# EAGLE design ziffy_board_v2 (EAGLE 6.5.0)
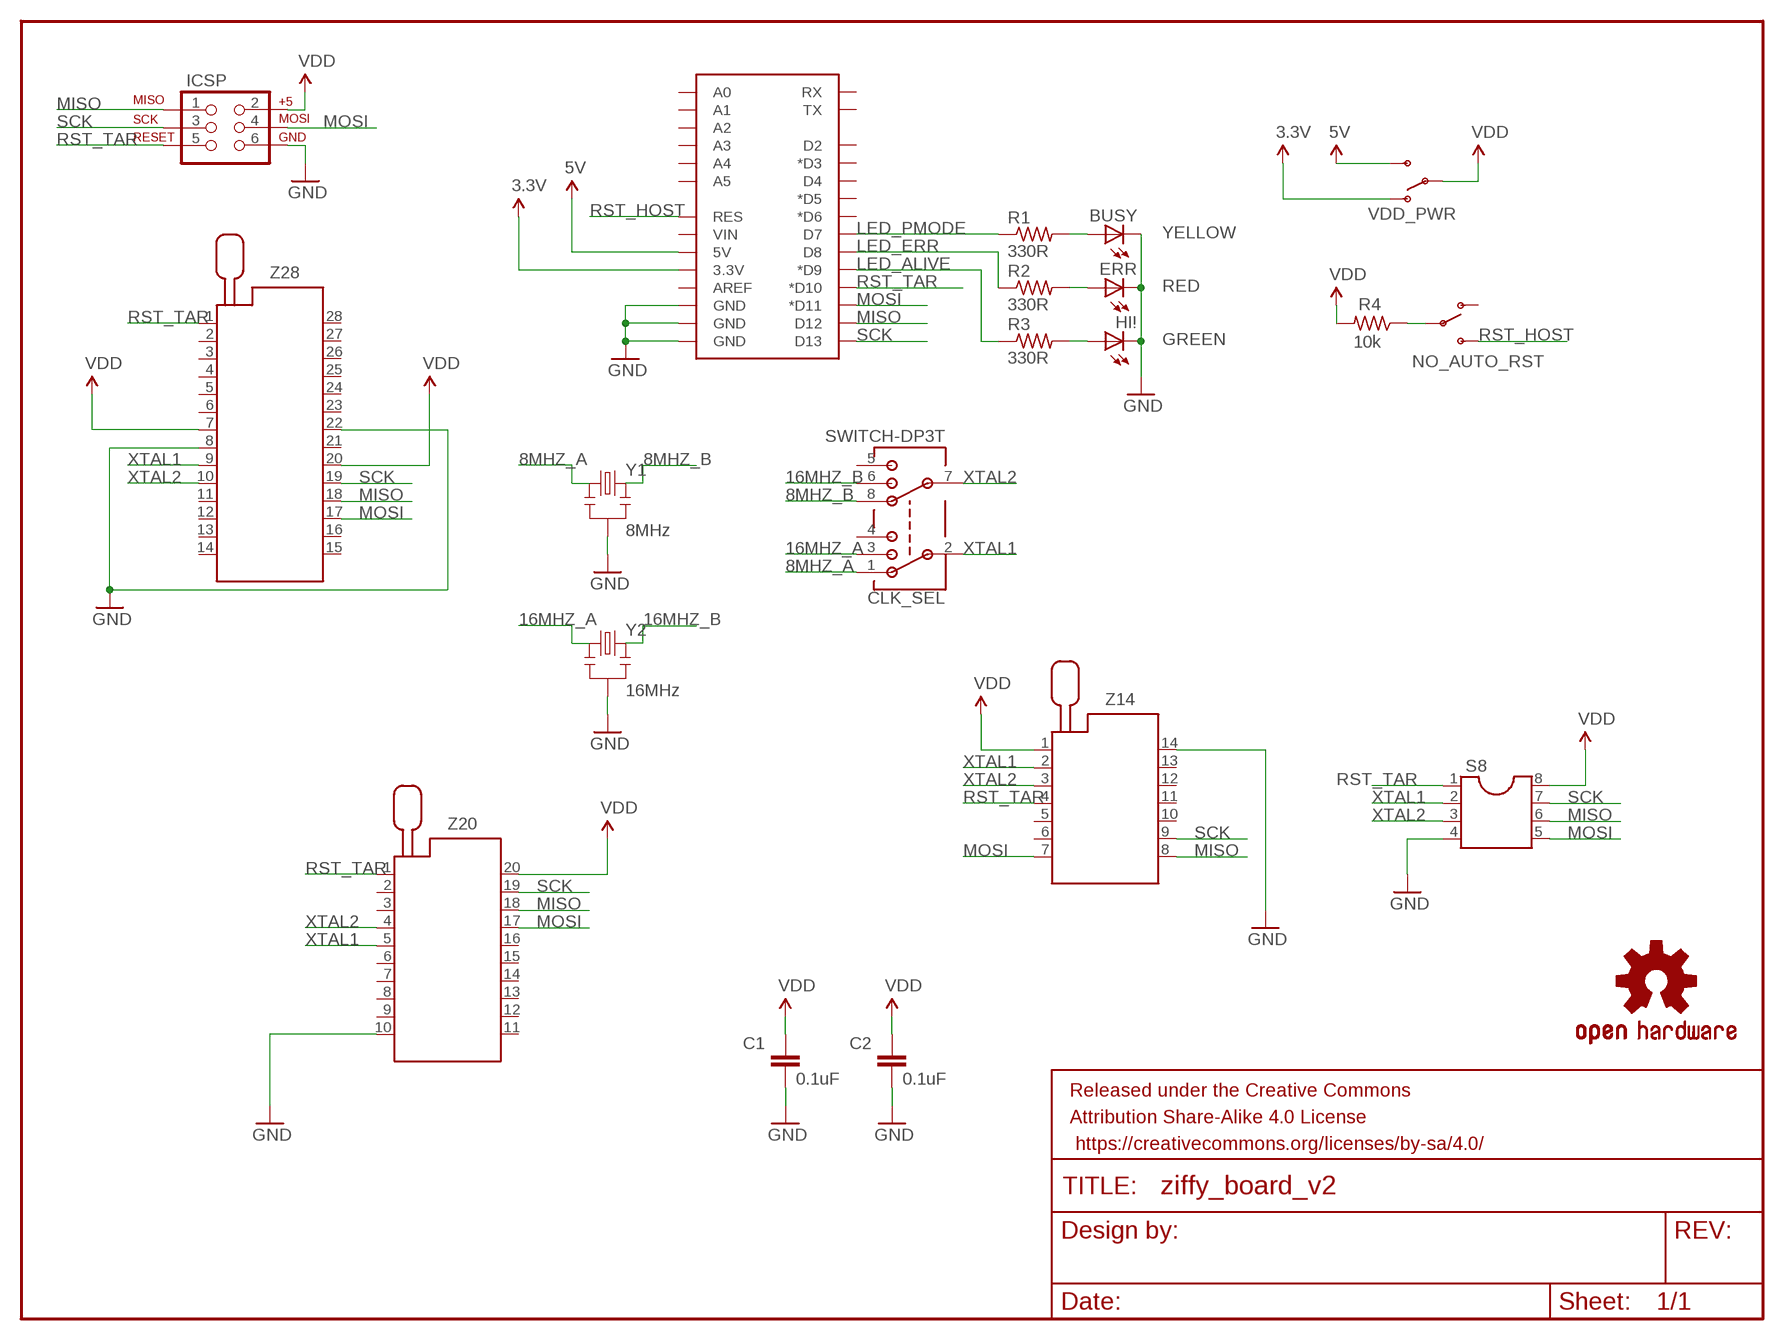
[diagram p0: schematic, sheet 1]

## Parts
BUSY  YELLOW  LED3MM  [LED3MM]
C1  0.1uF  C-EU025-025X050  [C025-025X050]
C2  0.1uF  C-EU025-025X050  [C025-025X050]
CLK_SEL  SWITCH-DP3T  [SWITCH-DP3T]
ERR  RED  LED3MM  [LED3MM]
FRAME1  FRAME-LETTER  [CREATIVE_COMMONS]
HI!  GREEN  LED3MM  [LED3MM]
ICSP  AVR_SPI_PRG_6PTH  [2X3]
LOGO1  OSHW-LOGOS  [OSHW-LOGO-S]
NO_AUTO_RST  SWITCH-SPDTPTH  [SWITCH-SPDT]
R1  330R  R-US_0204/5  [0204/5]
R2  330R  R-US_0204/5  [0204/5]
R3  330R  R-US_0204/5  [0204/5]
R4  10k  R-US_0204/5  [0204/5]
S8  DIPSHIT  DIL8  [DIL08]
U$1  ARDUINO_SHIELD  [SHIELD_NO_OUTLINE]
VDD_PWR  SWITCH-SPDTPTH  [SWITCH-SPDT]
Y1  8MHz  RESONATORPTH  [RESONATOR-PTH]
Y2  16MHz  RESONATORPTH  [RESONATOR-PTH]
Z14  ZIF14  [ZIF14]
Z20  ZIF20  [ZIF20]
Z28  ZIF28  [ZIF28]

## Nets
3.3V: U$1.3.3V VDD_PWR.1(O)
5V: U$1.5V VDD_PWR.3(S)
8MHZ_A: CLK_SEL.1 Y1.1
8MHZ_B: CLK_SEL.8 Y1.3
16MHZ_A: CLK_SEL.3 Y2.1
16MHZ_B: CLK_SEL.6 Y2.3
GND: BUSY.K(C) C1.2 C2.2 ERR.K(C) HI!.K(C) ICSP.6 S8.4 U$1.GND@0(GND) U$1.GND@1(GND) U$1.GND@2(GND) Y1.2 Y2.2 Z14.14 Z20.10 Z28.8 Z28.22
LED_ALIVE: R3.1 U$1.D9(*D9)
LED_ERR: R2.1 U$1.D8
LED_PMODE: R1.1 U$1.D7
MISO: ICSP.1 S8.6 U$1.D12 Z14.8 Z20.18 Z28.18
MOSI: ICSP.4 S8.5 U$1.D11(*D11) Z14.7 Z20.17 Z28.17
N$1: HI!.A R3.2
N$2: ERR.A R2.2
N$3: BUSY.A R1.2
N$4: NO_AUTO_RST.2(P) R4.1
RST_HOST: NO_AUTO_RST.3(S) U$1.RES
RST_TAR: ICSP.5 S8.1 U$1.D10(*D10) Z14.4 Z20.1 Z28.1
SCK: ICSP.3 S8.7 U$1.D13 Z14.9 Z20.19 Z28.19
VDD: C1.1 C2.1 ICSP.2 R4.2 S8.8 VDD_PWR.2(P) Z14.1 Z20.20 Z28.7 Z28.20
XTAL1: CLK_SEL.2 S8.2 Z14.2 Z20.5 Z28.9
XTAL2: CLK_SEL.7 S8.3 Z14.3 Z20.4 Z28.10
Unconnected: CLK_SEL.4 CLK_SEL.5 NO_AUTO_RST.1(O) U$1.A0 U$1.A1 U$1.A2 U$1.A3 U$1.A4 U$1.A5 U$1.AREF U$1.D2 U$1.D3(*D3) U$1.D4 U$1.D5(*D5) U$1.D6(*D6) U$1.RX U$1.TX U$1.VIN Z14.5 Z14.6 Z14.10 Z14.11 Z14.12 Z14.13 Z20.2 Z20.3 Z20.6 Z20.7 Z20.8 Z20.9 Z20.11 Z20.12 Z20.13 Z20.14 Z20.15 Z20.16 Z28.2 Z28.3 Z28.4 Z28.5 Z28.6 Z28.11 Z28.12 Z28.13 Z28.14 Z28.15 Z28.16 Z28.21 Z28.23 Z28.24 Z28.25 Z28.26 Z28.27 Z28.28

## Library data of the parts
BUSY ERR HI! = led:LED: LED OSRAM: - CHIPLED LG R971, LG N971, LY N971, LG Q971, LY Q971, LO R971, LY R971 LH N974, LH R974 LS Q976, LO Q976, LY Q976 LO Q996 - Hyper CHIPLED LW Q18S LB Q993, LB Q99A, LB R99A - SideLED LS A670, LO A670, LY A670, LG A670, LP A670 LB A673, LV A673, LT A673, LW A673 LH A674 LY A675 LS A676, LA A676, LO A676, LY A676, LW A676 LS A679, LY A679, LG A679 - Hyper Micro SIDELED® LS Y876, LA Y876, LO Y876, LY Y876 LT Y87S - SmartLED LW L88C, LW L88S LB L89C, LB L89S, LG L890 LS L89K, LO L89K, LY L89K LS L896, LA L896, LO L896, LY L896 - TOPLED LS T670, LO T670, LY T670, LG T670, LP T670 LSG T670, LSP T670, LSY T670, LOP T670, LYG T670 LG T671, LOG T671, LSG T671 LB T673, LV T673, LT T673, LW T673 LH T674 LS T676, LA T676, LO T676, LY T676, LB T676, LH T676, LSB T676, LW T676 LB T67C, LV T67C, LT T67C, LS T67K, LO T67K, LY T67K, LW E67C LS E67B, LA E67B, LO E67B, LY E67B, LB E67C, LV E67C, LT E67C LW T67C LS T679, LY T679, LG T679 LS T770, LO T770, LY T770, LG T770, LP T770 LB T773, LV T773, LT T773, LW T773 LH T774 LS E675, LA E675, LY E675, LS T675 LS T776, LA T776, LO T776, LY T776, LB T776 LHGB T686 LT T68C, LB T68C - Hyper Mini TOPLED® LB M676 - Mini TOPLED Santana® LG M470 LS M47K, LO M47K, LY M47K Source: http://www.osram.convergy.de LUXEON: - LUMILED® LXK2-PW12-R00, LXK2-PW12-S00, LXK2-PW14-U00, LXK2-PW14-V00 LXK2-PM12-R00, LXK2-PM12-S00, LXK2-PM14-U00 LXK2-PE12-Q00, LXK2-PE12-R00, LXK2-PE12-S00, LXK2-PE14-T00, LXK2-PE14-U00 LXK2-PB12-K00, LXK2-PB12-L00, LXK2-PB12-M00, LXK2-PB14-N00, LXK2-PB14-P00, LXK2-PB14-Q00 LXK2-PR12-L00, LXK2-PR12-M00, LXK2-PR14-Q00, LXK2-PR14-R00 LXK2-PD12-Q00, LXK2-PD12-R00, LXK2-PD12-S00 LXK2-PH12-R00, LXK2-PH12-S00 LXK2-PL12-P00, LXK2-PL12-Q00, LXK2-PL12-R00 Source: www.luxeon.com KINGBRIGHT: KA-3528ASYC Source: www.kingbright.com
C1 C2 = rcl:C-EU: CAPACITOR, European symbol
CLK_SEL = butts:SWITCH-DP3T
FRAME1 = SparkFun-Aesthetics:FRAME-LETTER: Schematic Frame Standard 8.5x11 US Letter frame
ICSP = SparkFun-Connectors:AVR_SPI_PRG_6: AVR ISP 6 Pin This is the reduced ISP connector for AVR programming. Common on Arduino. This footprint will take up less PCB space and can be used with a 10-pin to 6-pin adapter such as SKU: BOB-08508 **Special note about "TEST_POINT" package. The stop mask is on the top side, so if you want your programming test points to be on the bottom of your board, make sure to place this package on the bottom side of the board. This also ensure that the orientation to program from the bottom side will be correct.
LOGO1 = SparkFun-Aesthetics:OSHW-LOGO: Open Source Hardware Logo This logo indicates the piece of hardware it is found on incorporates a OSHW license and/or adheres to the definition of open source hardware found here: http://freedomdefined.org/OSHW
NO_AUTO_RST VDD_PWR = SparkFun-Electromechanical:SWITCH-SPDT: SPDT Switch Simple slide switch, Spark Fun Electronics SKU : COM-00102 DPDT SMT slide switch, AYZ0202, SWCH-08179
R1-R4 = rcl:R-US_: RESISTOR, American symbol
S8 = ic-package-mine:DIL8: Dual In Line / Socket
U$1 = butts:ARDUINO_SHIELD: Arduino shield footprint
Y1 Y2 = SparkFun-FreqCtrl:RESONATOR: Resonator Small SMD resonator. Used, eg, on the Arduino Pro/ Pro Mini boards. 8MHz- XTAL-08895 16MHz- XTAL-08900
Z14 = butts:ZIF14: Zero Insertion Force Socked Source: http://www.3M.com/ehpd; MF: 3M; MPN: 214-3339-00-0602J; OC_FARNELL: 1247151; OC_NEWARK: 85K7793
Z20 = butts:ZIF20: Zero Insertion Force Socked Source: http://www.3M.com/ehpd; MF: 3M; MPN: 220-3342-00-0602J; OC_FARNELL: 9897445; OC_NEWARK: 85K7807
Z28 = butts:ZIF28: Zero Insertion Force Socked Source: http://www.3M.com/ehpd

## Board
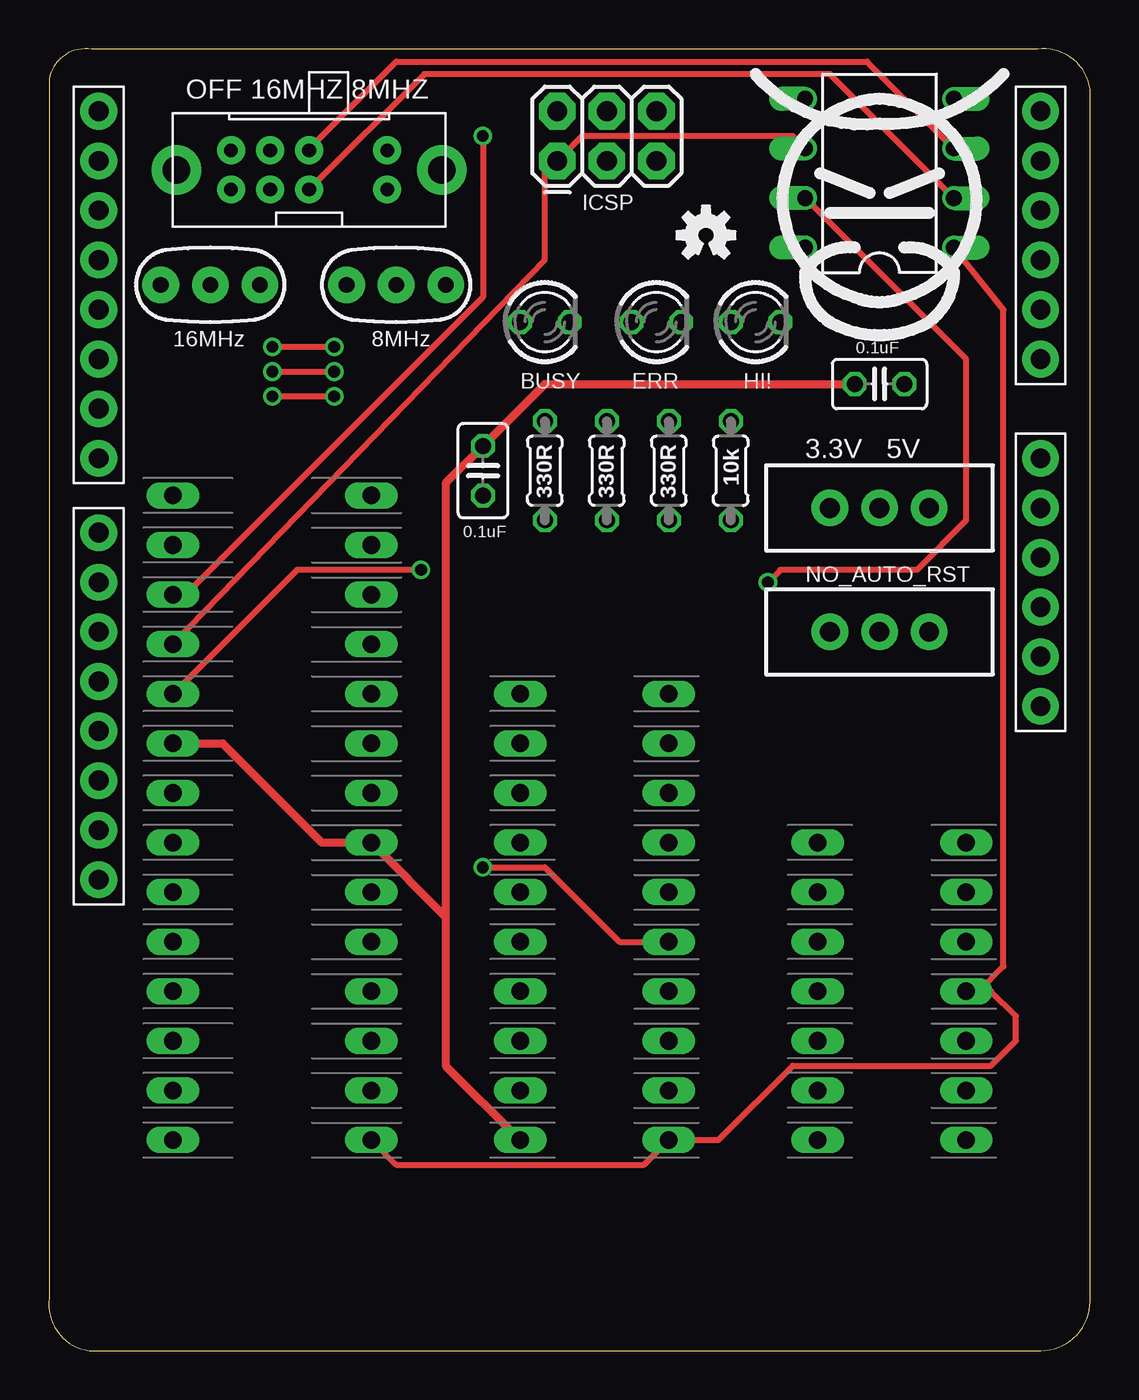
[diagram p1: board, top side]
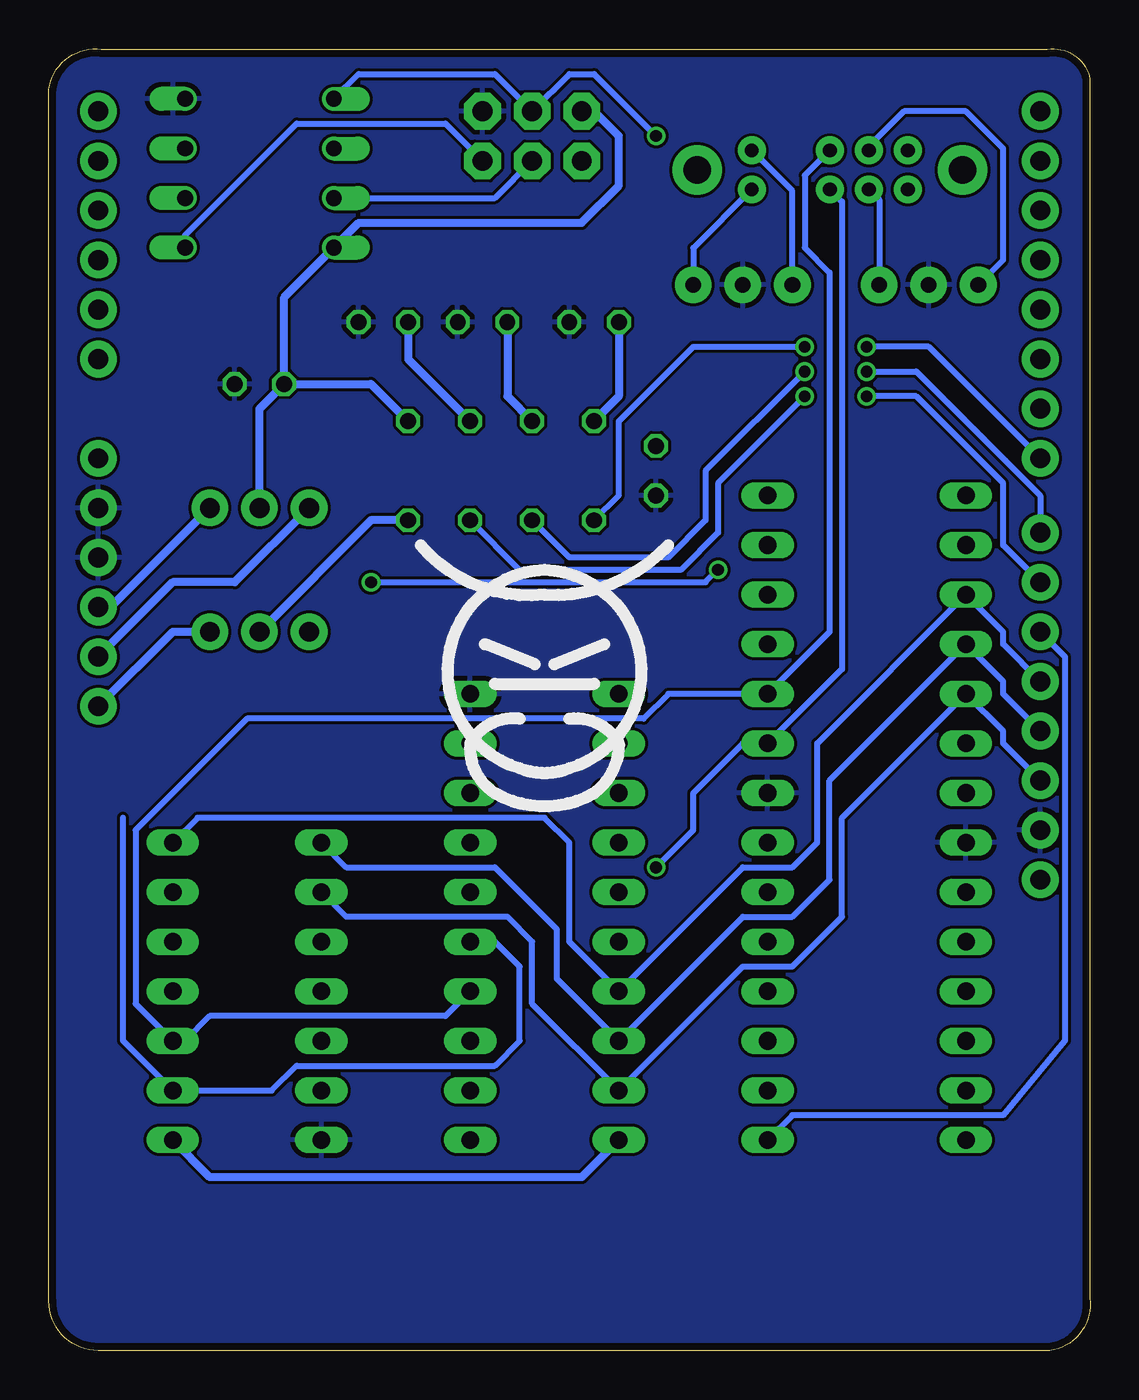
[diagram p2: board, bottom side, seen from below]

Size 53.36 x 66.7 mm. Coordinates in mm from the lower left corner, seen from the top.
Outline: 50.67,66.68 2.19,66.68 arc90 0.02,65.14 0.02,2.69 arc90 2.07,0 50.82,0 arc90 53.36,2.54 53.36,64.62 arc90 50.67,66.68
Copper layers (1*16): Top 0.0356mm / dielectric 1.5011mm / Bottom 0.0356mm
Design rules "LaenPCBOrder": minimum track width 6mil, minimum drill 13mil, track to track 6mil, track to pad 6mil, pad to pad 6mil, via to via 6mil, smd to smd 6mil, copper to edge 15mil, drill to drill 6mil, minimum pad ring 7mil, minimum via ring 7mil, stop-mask expansion 3mil, vias tented up to drill 0mil, thermal gap 10mil

### Footprints (pad centres in the part's own frame; a part is rotated, then mirrored left to right if it is on the bottom)
LED3MM = drill 0.813 octagon: A -1.27,0; K 1.27,0
C025-025X050 = drill 0.813 octagon: 1 -1.27,0; 2 1.27,0
SWITCH-DP3T = drill 0.7 pad 1.422: 1 3,4; 2 7,4; 3 9,4; 4 11,4; 5 11,2; 6 9,2; 7 7,2; 8 3,2 | drill 1.4 pad 2.54: MT1 0.2,3; MT3 13.8,3
2X3 = drill 1.016 pad 1.88 octagon: 1 0,0; 2 0,2.54; 3 2.54,0; 4 2.54,2.54; 5 5.08,0; 6 5.08,2.54
SWITCH-SPDT = drill 1.016 pad 1.88: 1 0,2.54; 2 0,0; 3 0,-2.54
0204/5 = drill 0.813 octagon: 1 -2.54,0; 2 2.54,0
DIL08 = drill 0.813 offset: 1 -3.81,-3.81; 2 -1.27,-3.81; 3 1.27,-3.81; 4 3.81,-3.81; 5 3.81,3.81; 6 1.27,3.81; 7 -1.27,3.81; 8 -3.81,3.81
SHIELD_NO_OUTLINE = drill 1.016 pad 1.88: 3.3V 50.8,13.97; 5V 50.8,16.51; A0 50.8,29.21; A1 50.8,31.75; A2 50.8,34.29; A3 50.8,36.83; A4 50.8,39.37; A5 50.8,41.91; AREF 2.54,2.54; D2 2.54,36.83; D3 2.54,34.29; D4 2.54,31.75; D5 2.54,29.21; D6 2.54,26.67; D7 2.54,24.13; D8 2.54,20.32; D9 2.54,17.78; D10 2.54,15.24; D11 2.54,12.7; D12 2.54,10.16; D13 2.54,7.62; GND@0 50.8,19.05; GND@1 50.8,21.59; GND@2 2.54,5.08; RES 50.8,11.43; RX 2.54,41.91; TX 2.54,39.37; VIN 50.8,24.13
RESONATOR-PTH = drill 0.8 pad 1.88: 1 -2.54,0; 2 0,0; 3 2.54,0
ZIF14 = drill 0.9 long: 1 -7.62,-3.81; 2 -5.08,-3.81; 3 -2.54,-3.81; 4 0,-3.81; 5 2.54,-3.81; 6 5.08,-3.81; 7 7.62,-3.81; 8 7.62,3.81; 9 5.08,3.81; 10 2.54,3.81; 11 0,3.81; 12 -2.54,3.81; 13 -5.08,3.81; 14 -7.62,3.81
ZIF20 = drill 0.9 long: 1 -11.43,-3.81; 2 -8.89,-3.81; 3 -6.35,-3.81; 4 -3.81,-3.81; 5 -1.27,-3.81; 6 1.27,-3.81; 7 3.81,-3.81; 8 6.35,-3.81; 9 8.89,-3.81; 10 11.43,-3.81; 11 11.43,3.81; 12 8.89,3.81; 13 6.35,3.81; 14 3.81,3.81; 15 1.27,3.81; 16 -1.27,3.81; 17 -3.81,3.81; 18 -6.35,3.81; 19 -8.89,3.81; 20 -11.43,3.81
ZIF28 = drill 0.9 long: 1 -16.51,-5.08; 2 -13.97,-5.08; 3 -11.43,-5.08; 4 -8.89,-5.08; 5 -6.35,-5.08; 6 -3.81,-5.08; 7 -1.27,-5.08; 8 1.27,-5.08; 9 3.81,-5.08; 10 6.35,-5.08; 11 8.89,-5.08; 12 11.43,-5.08; 13 13.97,-5.08; 14 16.51,-5.08; 15 16.51,5.08; 16 13.97,5.08; 17 11.43,5.08; 18 8.89,5.08; 19 6.35,5.08; 20 3.81,5.08; 21 1.27,5.08; 22 -1.27,5.08; 23 -3.81,5.08; 24 -6.35,5.08; 25 -8.89,5.08; 26 -11.43,5.08; 27 -13.97,5.08; 28 -16.51,5.08

### Placement (x,y rotation side)
BUSY  25.42,52.71 0 top
C1  22.24,45.09 270 top
C2  42.56,49.53 0 top
CLK_SEL  20.34,63.5 180 top
ERR  31.13,52.71 0 top
FRAME1  5.73,67.94 0 top
HI!  36.21,52.71 0 top
ICSP  26.05,60.96 0 top
LOGO1  33.67,57.15 0 top
NO_AUTO_RST  42.56,36.83 90 top
R1  25.42,45.09 90 top
R2  28.59,45.09 90 top
R3  31.77,45.09 90 top
R4  34.94,45.09 90 top
S8  42.56,60.32 90 top
U$1  0.02,21.59 0 top
U$2  [COW]  27.96,33.66 0 bottom
U$3  [COW]  42.56,57.79 0 top
VDD_PWR  42.56,43.18 90 top
Y1  17.8,54.61 180 top
Y2  8.27,54.61 180 top
Z14  43.2,18.41 90 top
Z20  27.96,22.23 90 top
Z28  11.45,27.3 90 top

### Tracks (layer width: path | path; a pad name or v marks a point on that pad's centre or on a via)
3.3V
  Bottom 0.406: VDD_PWR.1 43.83,39.37 47.01,39.37 U$1.3.3V
5V
  Bottom 0.406: U$1.5V 50.18,38.1 VDD_PWR.3
8MHZ_A
  Bottom 0.305: CLK_SEL.1 20.34,56.5 Y1.1
8MHZ_B
  Bottom 0.305: Y1.3 15.26,59.42 CLK_SEL.8
16MHZ_A
  Bottom 0.305: CLK_SEL.3 10.81,58.98 Y2.1
16MHZ_B
  Bottom 0.305: Y2.3 4.46,55.88 4.46,61.6 6.37,63.5 9.54,63.5 11.34,61.71 CLK_SEL.6
GND
  pour Bottom: 0.02,64.77 arc-90 1.92,66.68 50.82,66.68 arc-90 53.36,64.77 53.36,2.54 arc-90 50.18,0 1.92,0 arc-90 0.02,2.54
LED_ALIVE  (via drill 0.6)
  Top 0.305: v11.45,48.89 v14.62,48.89
  Bottom 0.305: R3.1 29.23,40.01 20.97,40.01 19.07,41.91 19.07,44.45 v14.62,48.89 | U$1.D9 4.46,41.27 4.46,44.45 8.91,48.89 v11.45,48.89
LED_ERR  (via drill 0.6)
  Top 0.305: v11.45,50.16 v14.62,50.16
  Bottom 0.305: v11.45,50.16 8.91,50.16 2.56,43.81 U$1.D8 | v14.62,50.16 19.7,45.09 19.7,42.55 21.61,40.64 26.69,40.64 R2.1
LED_PMODE  (via drill 0.6)
  Top 0.305: v11.45,51.43 v14.62,51.43
  Bottom 0.305: U$1.D7 8.27,51.43 v11.45,51.43 | R1.1 24.15,43.81 24.15,47.62 20.34,51.43 v14.62,51.43
MISO
  Top 0.305: S8.6 38.12,62.23 27.32,62.23 ICSP.1 25.42,60.32 25.42,55.88 Z28.18
  Bottom 0.305: U$1.D12 4.46,33.66 4.46,34.29 Z28.18 13.35,29.21 13.35,24.13 15.26,22.23 17.8,22.23 Z20.18 27.32,19.05 27.32,21.59 30.5,24.77 38.12,24.77 Z14.8
MOSI  (via drill 0.6)
  Top 0.305: v22.24,62.23 22.24,53.98 7,38.73 Z28.17
  Bottom 0.305: S8.5 37.48,65.41 30.5,65.41 ICSP.4 26.69,65.41 25.42,65.41 v22.24,62.23 | U$1.D11 4.46,36.2 4.46,36.83 Z28.17 13.99,31.12 13.99,26.03 15.26,24.77 17.8,24.77 Z20.17 26.69,20.95 26.69,26.03 27.96,27.3 45.74,27.3 Z14.7
N$1
  Bottom 0.406: HI!.A 34.94,50.8 R3.2
N$2
  Bottom 0.406: ERR.A 29.86,48.89 R2.2
N$3
  Bottom 0.406: BUSY.A 24.15,48.89 R1.2
N$4
  Bottom 0.406: R4.1 36.85,42.55 NO_AUTO_RST.2
RST_HOST
  Bottom 0.406: NO_AUTO_RST.3 47.01,36.83 U$1.RES
RST_TAR
  Top 0.305: Z28.1 17.8,9.52 30.5,9.52 Z20.1 34.31,10.79 38.12,14.61 48.28,14.61 49.55,15.88 49.55,17.14 48.28,18.41 47.64,18.41 | 47.64,18.41 Z14.4 | S8.1 48.91,53.34 48.91,19.69 47.64,18.41
  Bottom 0.305: S8.1 46.37,57.15 40.66,62.87 33.04,62.87 ICSP.5 | U$1.D10 1.29,35.56 1.29,15.88 4.46,12.06 15.26,12.06 Z28.1
SCK  (via drill 0.6)
  Top 0.305: v36.85,39.37 37.48,40.01 44.47,40.01 47.01,42.55 47.01,50.8 S8.7 | v19.07,40.01 12.72,40.01 Z28.19
  Bottom 0.305: S8.7 30.5,59.05 ICSP.3 | U$1.D13 4.46,31.12 4.46,31.75 Z28.19 12.72,27.3 12.72,22.23 15.26,19.69 17.8,19.69 Z20.19 28.59,17.78 28.59,20.95 29.86,22.23 38.12,22.23 Z14.9 | v36.85,39.37 19.7,39.37 v19.07,40.01
VDD
  Top 0.406: Z28.20 8.91,31.12 13.99,26.03 Z28.7 20.34,22.23 | C2.1 25.42,49.53 C1.1 20.34,44.45 20.34,22.23 | 20.34,22.23 20.34,14.61 Z20.20
  Bottom 0.406: VDD_PWR.2 42.56,48.26 C2.1 | C2.1 36.85,49.53 R4.2 | C2.1 41.29,53.98 S8.8 37.48,57.79 26.05,57.79 24.15,59.69 24.15,62.23 25.42,63.5 ICSP.2 | Z20.20 26.05,8.89 45.1,8.89 Z14.1
XTAL1  (via drill 0.6)
  Top 0.305: v22.24,24.77 25.42,24.77 29.23,20.95 Z20.5 | S8.2 40.02,65.41 19.24,65.41 CLK_SEL.2
  Bottom 0.305: CLK_SEL.2 12.72,58.88 12.72,34.92 Z28.9 17.8,31.12 20.34,28.57 20.34,26.67 v22.24,24.77 | 49.55,27.3 49.55,15.88 Z14.2 41.93,13.34 40.66,14.61 30.5,14.61 29.23,15.88 29.23,19.69 30.5,20.95 Z20.5
XTAL2
  Top 0.305: S8.3 41.93,66.04 17.8,66.04 13.34,61.58 CLK_SEL.7
  Bottom 0.305: Z20.4 33.04,17.14 45.1,17.14 46.37,15.88 Z14.3 48.91,17.78 48.91,26.67 43.2,32.38 22.88,32.38 21.61,33.66 Z28.10 13.35,36.83 13.35,55.24 14.62,56.51 14.62,60.21 CLK_SEL.7

### Text on the board
tPlace: OFF 16MHZ 8MHZ | 3.3V 5V
Reference: schizobovine <sean@yak.net>